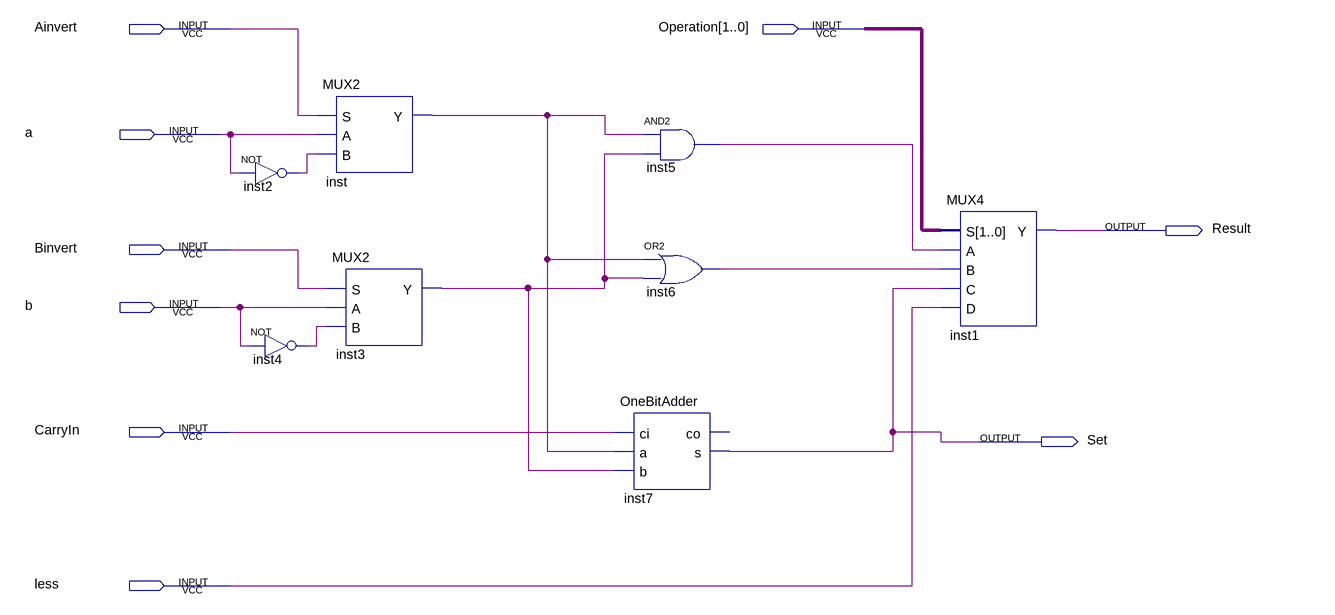
[diagram p0: schematic sheet]
// Quartus schematic ALUBit31.bdf as structural Verilog: 8 symbols, 9 pins
module ALUBit31 (
  input  Ainvert,
  input  [1:0] Operation,
  input  a,
  input  Binvert,
  input  b,
  input  CarryIn,
  input  less,
  output Result,
  output Set
);

  wire inst2_out, inst3_y, inst4_out, inst5_out, inst6_out, inst_y;

  not inst2 (inst2_out, a);
  not inst4 (inst4_out, b);
  MUX2 inst (.S(Ainvert), .A(a), .B(inst2_out), .Y(inst_y));
  MUX2 inst3 (.S(Binvert), .A(b), .B(inst4_out), .Y(inst3_y));
  and inst5 (inst5_out, inst_y, inst3_y);
  or inst6 (inst6_out, inst_y, inst3_y);
  OneBitAdder inst7 (.ci(CarryIn), .a(inst_y), .b(inst3_y), .s(Set));  // open: co
  MUX4 inst1 (.S(Operation), .A(inst5_out), .B(inst6_out), .C(Set), .D(less), .Y(Result));
endmodule
